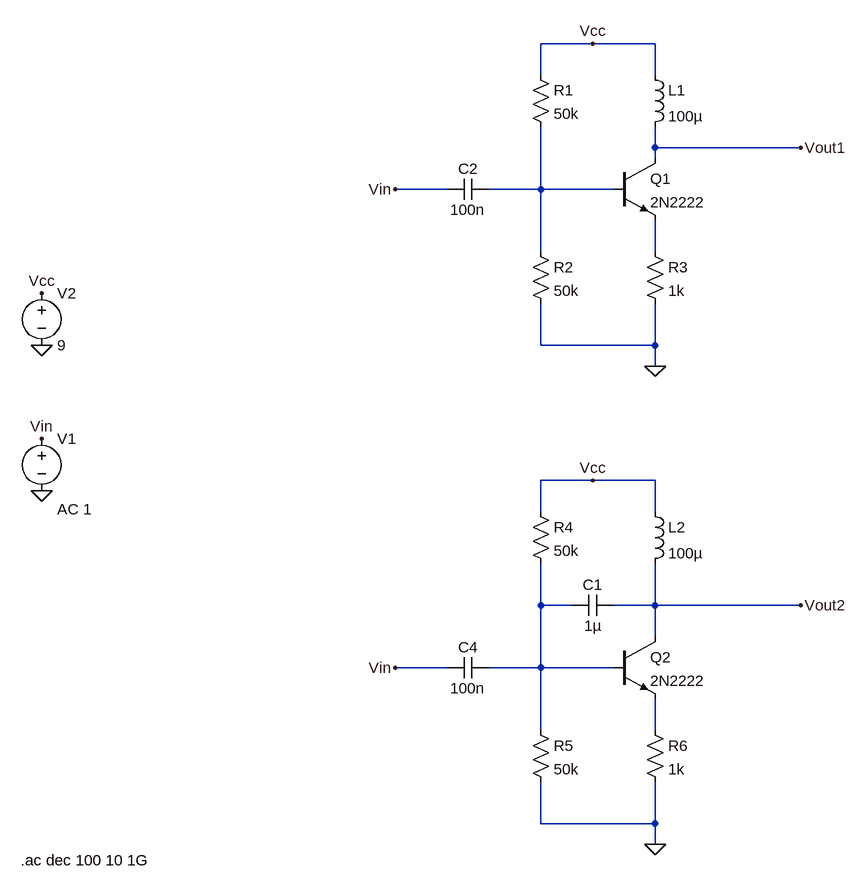
[diagram p0: schematic bjt_emitter_follower.asc]
bjt_emitter_follower.asc, the LTspice schematic file:
Version 4
SHEET 1 880 1160
WIRE 160 -112 80 -112
WIRE 256 -112 160 -112
WIRE 80 -64 80 -112
WIRE 256 -64 256 -112
WIRE 256 48 256 16
WIRE 480 48 256 48
WIRE 256 64 256 48
WIRE -64 112 -144 112
WIRE 80 112 80 16
WIRE 80 112 0 112
WIRE 192 112 80 112
WIRE 80 208 80 112
WIRE 256 208 256 160
WIRE 80 352 80 288
WIRE 256 352 256 288
WIRE 256 352 80 352
WIRE 256 384 256 352
WIRE 160 560 80 560
WIRE 256 560 160 560
WIRE 80 608 80 560
WIRE 256 608 256 560
WIRE 80 752 80 688
WIRE 128 752 80 752
WIRE 256 752 256 688
WIRE 256 752 192 752
WIRE 480 752 256 752
WIRE 256 800 256 752
WIRE -64 848 -144 848
WIRE 80 848 80 752
WIRE 80 848 0 848
WIRE 192 848 80 848
WIRE 80 944 80 848
WIRE 256 944 256 896
WIRE 80 1088 80 1024
WIRE 256 1088 256 1024
WIRE 256 1088 80 1088
WIRE 256 1120 256 1088
FLAG 160 -112 Vcc
FLAG 256 384 0
FLAG -144 112 Vin
FLAG 480 48 Vout1
FLAG 160 560 Vcc
FLAG 256 1120 0
FLAG -144 848 Vin
FLAG 480 752 Vout2
FLAG -688 352 0
FLAG -688 272 Vcc
FLAG -688 496 Vin
FLAG -688 576 0
SYMBOL npn 192 64 R0
SYMATTR InstName Q1
SYMATTR Value 2N2222
SYMBOL ind 240 -80 R0
SYMATTR InstName L1
SYMATTR Value 100µ
SYMBOL res 64 -80 R0
SYMATTR InstName R1
SYMATTR Value 50k
SYMBOL res 64 192 R0
SYMATTR InstName R2
SYMATTR Value 50k
SYMBOL res 240 192 R0
SYMATTR InstName R3
SYMATTR Value 1k
SYMBOL cap 0 96 R90
WINDOW 0 0 32 VBottom 2
WINDOW 3 32 32 VTop 2
SYMATTR InstName C2
SYMATTR Value 100n
SYMBOL npn 192 800 R0
SYMATTR InstName Q2
SYMATTR Value 2N2222
SYMBOL ind 240 592 R0
SYMATTR InstName L2
SYMATTR Value 100µ
SYMBOL res 64 928 R0
SYMATTR InstName R5
SYMATTR Value 50k
SYMBOL res 240 928 R0
SYMATTR InstName R6
SYMATTR Value 1k
SYMBOL cap 0 832 R90
WINDOW 0 0 32 VBottom 2
WINDOW 3 32 32 VTop 2
SYMATTR InstName C4
SYMATTR Value 100n
SYMBOL voltage -688 480 R0
WINDOW 123 24 124 Left 2
WINDOW 39 0 0 Left 0
SYMATTR Value2 AC 1
SYMATTR InstName V1
SYMATTR Value ""
SYMBOL voltage -688 256 R0
WINDOW 123 0 0 Left 0
WINDOW 39 0 0 Left 0
SYMATTR InstName V2
SYMATTR Value 9
SYMBOL res 64 592 R0
SYMATTR InstName R4
SYMATTR Value 50k
SYMBOL cap 192 736 R90
WINDOW 0 0 32 VBottom 2
WINDOW 3 32 32 VTop 2
SYMATTR InstName C1
SYMATTR Value 1µ
TEXT -720 1144 Left 2 !.ac dec 100 10 1G

The netlist it stands for:
* bjt_emitter_follower.asc
Q1 Vout1 N001 N002 0 2N2222
L1 Vcc Vout1 100µ
R1 Vcc N001 50k
R2 N001 0 50k
R3 N002 0 1k
C2 N001 Vin 100n
Q2 Vout2 N003 N004 0 2N2222
L2 Vcc Vout2 100µ
R5 N003 0 50k
R6 N004 0 1k
C4 N003 Vin 100n
V1 Vin 0 AC 1
V2 Vcc 0 9
R4 Vcc N003 50k
C1 Vout2 N003 1µ
.model NPN NPN
.model PNP PNP
.lib standard.bjt
.ac dec 100 10 1G
.backanno
.end